# Altium schematic sheet p11_LVDS.SchDoc
size 386 x 246 mm
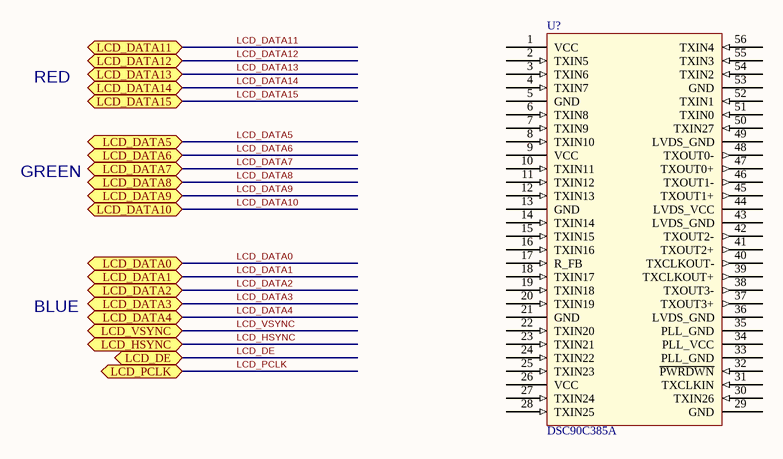
[diagram p0: p11_LVDS.SchDoc]

## Parts
U?  DSC90C385A  [TSSOP56]

## Ports
LCD_DATA0, LCD_DATA1, LCD_DATA2, LCD_DATA3, LCD_DATA4, LCD_DATA5, LCD_DATA6, LCD_DATA7, LCD_DATA8, LCD_DATA9, LCD_DATA10, LCD_DATA11, LCD_DATA12, LCD_DATA13, LCD_DATA14, LCD_DATA15, LCD_DE, LCD_HSYNC, LCD_PCLK, LCD_VSYNC

## Nets
LCD_DATA0: port LCD_DATA0
LCD_DATA1: port LCD_DATA1
LCD_DATA2: port LCD_DATA2
LCD_DATA3: port LCD_DATA3
LCD_DATA4: port LCD_DATA4
LCD_DATA5: port LCD_DATA5
LCD_DATA6: port LCD_DATA6
LCD_DATA7: port LCD_DATA7
LCD_DATA8: port LCD_DATA8
LCD_DATA9: port LCD_DATA9
LCD_DATA10: port LCD_DATA10
LCD_DATA11: port LCD_DATA11
LCD_DATA12: port LCD_DATA12
LCD_DATA13: port LCD_DATA13
LCD_DATA14: port LCD_DATA14
LCD_DATA15: port LCD_DATA15
LCD_DE: port LCD_DE
LCD_HSYNC: port LCD_HSYNC
LCD_PCLK: port LCD_PCLK
LCD_VSYNC: port LCD_VSYNC

Not connected (* = marked no-connect by the designer): U? 1(VCC) 2(TXIN5) 3(TXIN6) 4(TXIN7) 5(GND) 6(TXIN8) 7(TXIN9) 8(TXIN10) 9(VCC) 10(TXIN11) 11(TXIN12) 12(TXIN13) 13(GND) 14(TXIN14) 15(TXIN15) 16(TXIN16) 17(R_FB) 18(TXIN17) 19(TXIN18) 20(TXIN19) 21(GND) 22(TXIN20) 23(TXIN21) 24(TXIN22) 25(TXIN23) 26(VCC) 27(TXIN24) 28(TXIN25) 29(GND) 30(TXIN26) 31(TXCLKIN) 32(~{PWRDWN}) 33(PLL_GND) 34(PLL_VCC) 35(PLL_GND) 36(LVDS_GND) 37(TXOUT3+) 38(TXOUT3-) 39(TXCLKOUT+) 40(TXCLKOUT-) 41(TXOUT2+) 42(TXOUT2-) 43(LVDS_GND) 44(LVDS_VCC) 45(TXOUT1+) 46(TXOUT1-) 47(TXOUT0+) 48(TXOUT0-) 49(LVDS_GND) 50(TXIN27) 51(TXIN0) 52(TXIN1) 53(GND) 54(TXIN2) 55(TXIN3) 56(TXIN4)

## Notes on the sheet
- RED
- GREEN
- BLUE

## Library data of the parts
U? = DS90C385A: IC TX LVDS FPD 24BIT 56TSSOP; Manufacturer: Texas Instruments; Manufacturer Part Number: DS90C385AMTX/NOPB; Protocol: FPD-Link, LVDS; Number of Drivers/Receivers: 5/0; Data Rate: 2.45Gbps; Voltage - Supply: 3 V ~ 3.6 V; Supplier 1: Digi-Key; RoHS: RoHS Compliant; Category: Integrated Circuits (ICs); Stock 1: 2071; Pricing 1: 1=4.92, 10=4.412, 25=3.9672, 100=2.3085, 250=2.26576, 500=2.223 (USD); Packaging: Cut Tape (CT); Type: Driver; Duplex: -; Receiver Hysteresis: -; Operating Temperature: -10°C ~ 70°C; Mounting Type: Surface Mount; Package / Case: 56-TFSOP (0.240", 6.10mm Width); Supplier Device Package: 56-TSSOP; ComponentLink1URL: http://www.ti.com/lit/ds/symlink/ds90c385a.pdf; ComponentLink1Description: http://www.ti.com/lit/ds/symlink/ds90c385a.pdf; Supplier Part Number 1: DS90C385AMTX/NOPBCT-ND